# Altium schematic sheet WWOL_main.SchDoc
size A4; SheetNumber: 1; SheetTotal: 2
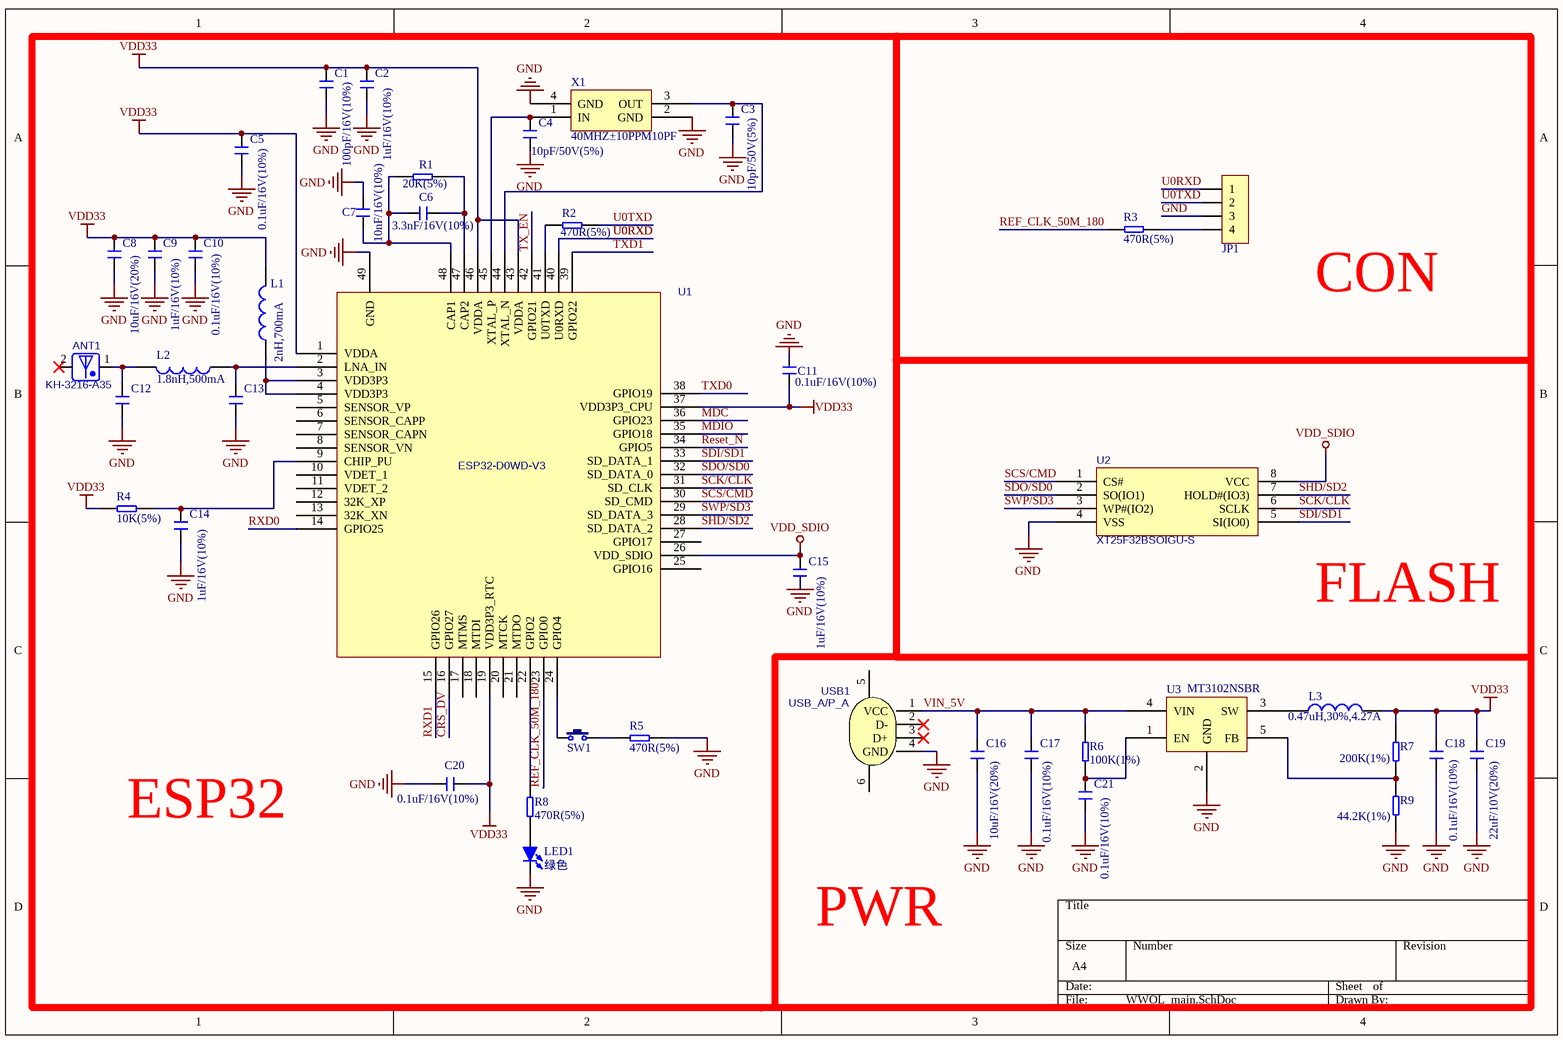
[diagram p0: WWOL_main.SchDoc]

## Parts
ANT1  KH-3216-A35  [ANT-SMD-2_L3.2-W1.6-C504002]
C1  100pF/16V(10%)  [C0402]
C2  1uF/16V(10%)  [C0402]
C3  10pF/50V(5%)  [C0402]
C4  10pF/50V(5%)  [C0402]
C5  0.1uF/16V(10%)  [C0402]
C6  3.3nF/16V(10%)  [C0402]
C7  10nF/16V(10%)  [C0402]
C8  10uF/16V(20%)  [C0402]
C9  1uF/16V(10%)  [C0402]
C10  0.1uF/16V(10%)  [C0402]
C11  0.1uF/16V(10%)  [C0402]
C12  (no value)  [C0402]
C13  (no value)  [C0402]
C14  1uF/16V(10%)  [C0402]
C15  1uF/16V(10%)  [C0402]
C16  10uF/16V(20%)  [C0402]
C17  0.1uF/16V(10%)  [C0402]
C18  0.1uF/16V(10%)  [C0402]
C19  22uF/10V(20%)  [C0402]
C20  0.1uF/16V(10%)  [C0402]
C21  0.1uF/16V(10%)  [C0402]
JP1  HDR-1X4  [HDR2.54-LI-4P]  (value not drawn)
L1  2nH,700mA  [L0402]
L2  1.8nH,500mA  [L0402]
L3  0.47uH,30%,4.27A  [NR2520]
LED1  绿色  [LED 0402G]
R1  20K(5%)  [R0402]
R2  470R(5%)  [R0402]
R3  470R(5%)  [R0402]
R4  10K(5%)  [R0402]
R5  470R(5%)  [R0402]
R6  100K(1%)  [R0402]
R7  200K(1%)  [R0402]
R8  470R(5%)  [R0402]
R9  44.2K(1%)  [R0402]
SW1  TSW SMD-3*6*2.5  [TSW SMD-3*6*2.5]  (value not drawn)
U1  ESP32-D0WD-V3  [QFN35P500X500X90_HS-49N]
U2  XT25F32BSOIGU-S  [SOP127P600X175-8N]
U3  MT3102NSBR  [SOT95P280X145-5N]
USB1  USB_A/P_A  [USB_A/P_A]
X1  40MHZ±10PPM10PF  [SMD2520-4P]

## Blocks framed on the sheet
ESP32: ANT1 C1-C15 C20 L1 L2 LED1 R1 R2 R4 R5 R8 SW1 U1 X1

## Nets
GND: C1.1 C2.1 C3.1 C4.1 C5.1 C7.2 C8.1 C9.1 C10.1 C11.1 C12.1 C13.1 C14.1 C15.1 C16.1 C17.1 C18.1 C19.1 C20.1 C21.1 JP1.3 LED1.2(K) R5.1 R9.1 U1.49(GND) U2.4(VSS) U3.2(GND) USB1.4(GND) X1.2(GND) X1.4(GND)
VDD33: C1.2 C2.2 C5.2 C8.2 C9.2 C10.2 C11.2 C18.2 C19.2 C20.2 L1.2 L3.2 R4.2 R7.2 U1.1(VDDA) U1.19(VDD3P3_RTC) U1.37(VDD3P3_CPU) U1.43(VDDA) U1.46(VDDA)
VDD_SDIO: C15.2 U1.26(VDD_SDIO) U2.8(VCC)
CRS_DV: U1.16(GPIO27)
MDC: U1.36(GPIO23)
MDIO: U1.35(GPIO18)
REF_CLK_50M_180: R3.2 U1.23(GPIO0)
Reset_N: U1.34(GPIO5)
RXD0: U1.14(GPIO25)
RXD1: U1.15(GPIO26)
SCK/CLK: U1.31(SD_CLK) U2.6(SCLK)
SCS/CMD: U1.30(SD_CMD) U2.1(CS#)
SDI/SD1: U1.33(SD_DATA_1) U2.5(SI(IO0))
SDO/SD0: U1.32(SD_DATA_0) U2.2(SO(IO1))
SHD/SD2: U1.28(SD_DATA_2) U2.7(HOLD#(IO3))
SWP/SD3: U1.29(SD_DATA_3) U2.3(WP#(IO2))
TX_EN: U1.42(GPIO21)
TXD0: U1.38(GPIO19)
TXD1: U1.39(GPIO22)
U0RXD: JP1.1 U1.40(U0RXD)
U0TXD: JP1.2 R2.1
VIN_5V: C16.2 C17.2 R6.2 U3.4(VIN) USB1.1(VCC)
NetANT1_1: ANT1.1 C12.2 L2.2
NetC3_2: C3.2 U1.44(XTAL_N) X1.3(OUT)
NetC4_2: C4.2 U1.45(XTAL_P) X1.1(IN)
NetC6_1: C6.1 R1.1 U1.47(CAP2)
NetC6_2: C6.2 C7.1 R1.2 U1.48(CAP1)
NetC13_2: C13.2 L2.1 U1.2(LNA_IN)
NetC14_2: C14.2 R4.1 U1.9(CHIP_PU)
NetC21_2: C21.2 R6.1 U3.1(EN)
NetJP1_4: JP1.4 R3.1
NetL1_1: L1.1 U1.3(VDD3P3) U1.4(VDD3P3)
NetL3_1: L3.1 U3.3(SW)
NetLED1_1: LED1.1(A) R8.1
NetR2_2: R2.2 U1.41(U0TXD)
NetR5_2: R5.2 SW1.2
NetR7_1: R7.1 R9.2 U3.5(FB)
NetR8_2: R8.2 U1.22(GPIO2)
NetSW1_1: SW1.1 U1.24(GPIO4)

Not connected (* = marked no-connect by the designer): ANT1 2*; U1 5(SENSOR_VP) 6(SENSOR_CAPP) 7(SENSOR_CAPN) 8(SENSOR_VN) 10(VDET_1) 11(VDET_2) 12(32K_XP) 13(32K_XN) 17(MTMS) 18(MTDI) 20(MTCK) 21(MTDO) 25(GPIO16) 27(GPIO17); USB1 2(D-)* 3(D+)* 5 6

## Notes on the sheet
- CON
- FLASH
- PWR

## Library data of the parts
ANT1 = KH-3216-A35: 金航标 KH-3216-A35; BOM_Manufacturer: kinghelm(金航标); Contributor: LCSC; BOM_Supplier: LCSC; BOM_Supplier Part: C504002; BOM_Manufacturer Part: KH-3216-A35; BOM_JLCPCB Part Class: Extended Part; spicePre: L; spiceSymbolName: KH-3216-A35
C1-C21 = C: 无极性贴片电容; 版权归属: 源创客; BOM名称: 无极性贴片电容; 学习资源: www.ooocke.com
JP1 = Header 4: 4P接插件; 版权归属: 源创客; BOM名称: 4P接插件; 学习资源: www.ooocke.com
L1 L2 = L: 小功率贴片电感
L3 = L: muRata(村田) DFE252012F-4R7M=P2
LED1 = LED-SMD: 贴片LED; 版权归属: 源创客; BOM名称: 贴片LED; 学习资源: www.ooocke.com
R1-R9 = R: 贴片电阻
SW1 = TSW 3x6: 3x6轻触开关; 版权归属: 源创客; BOM名称: 3x6轻触开关; 学习资源: www.ooocke.com
U1 = ESP32-D0WD-V3: BOM_Manufacturer: ESPRESSIF 乐鑫; Contributor: LCSC; BOM_Supplier: LCSC; BOM_Supplier Part: C967021; BOM_Manufacturer Part: ESP32-D0WD-V3; BOM_JLCPCB Part Class: Extended Part; Frequency: -; spicePre: U; spiceSymbolName: ESP32-D0WD-V3
U2 = XT25F32BSOIGU-S: spi flash; BOM_Manufacturer: XTX; Contributor: LCSC; BOM_Supplier: LCSC; BOM_Supplier Part: C558851; BOM_Manufacturer Part: XT25F32BSOIGU-S; BOM_JLCPCB Part Class: Extended Part; spicePre: U; spiceSymbolName: XT25F32BSOIGU-S
U3 = MT3102NSBR: 开关电源
USB1 = USB_A/P_A: 精拓金 917-181A102ED60200; BOM_Manufacturer: SOFNG; BOM_Manufacturer Part: USB-07; Contributor: LCSC; BOM_Supplier: LCSC; BOM_Supplier Part: C183610; BOM_JLCPCB Part Class: Extended Part; spicePre: U; spiceSymbolName: USB-07
X1 = XTAL-4P: 无源晶振